# Altium project keyModule.PrjPcb
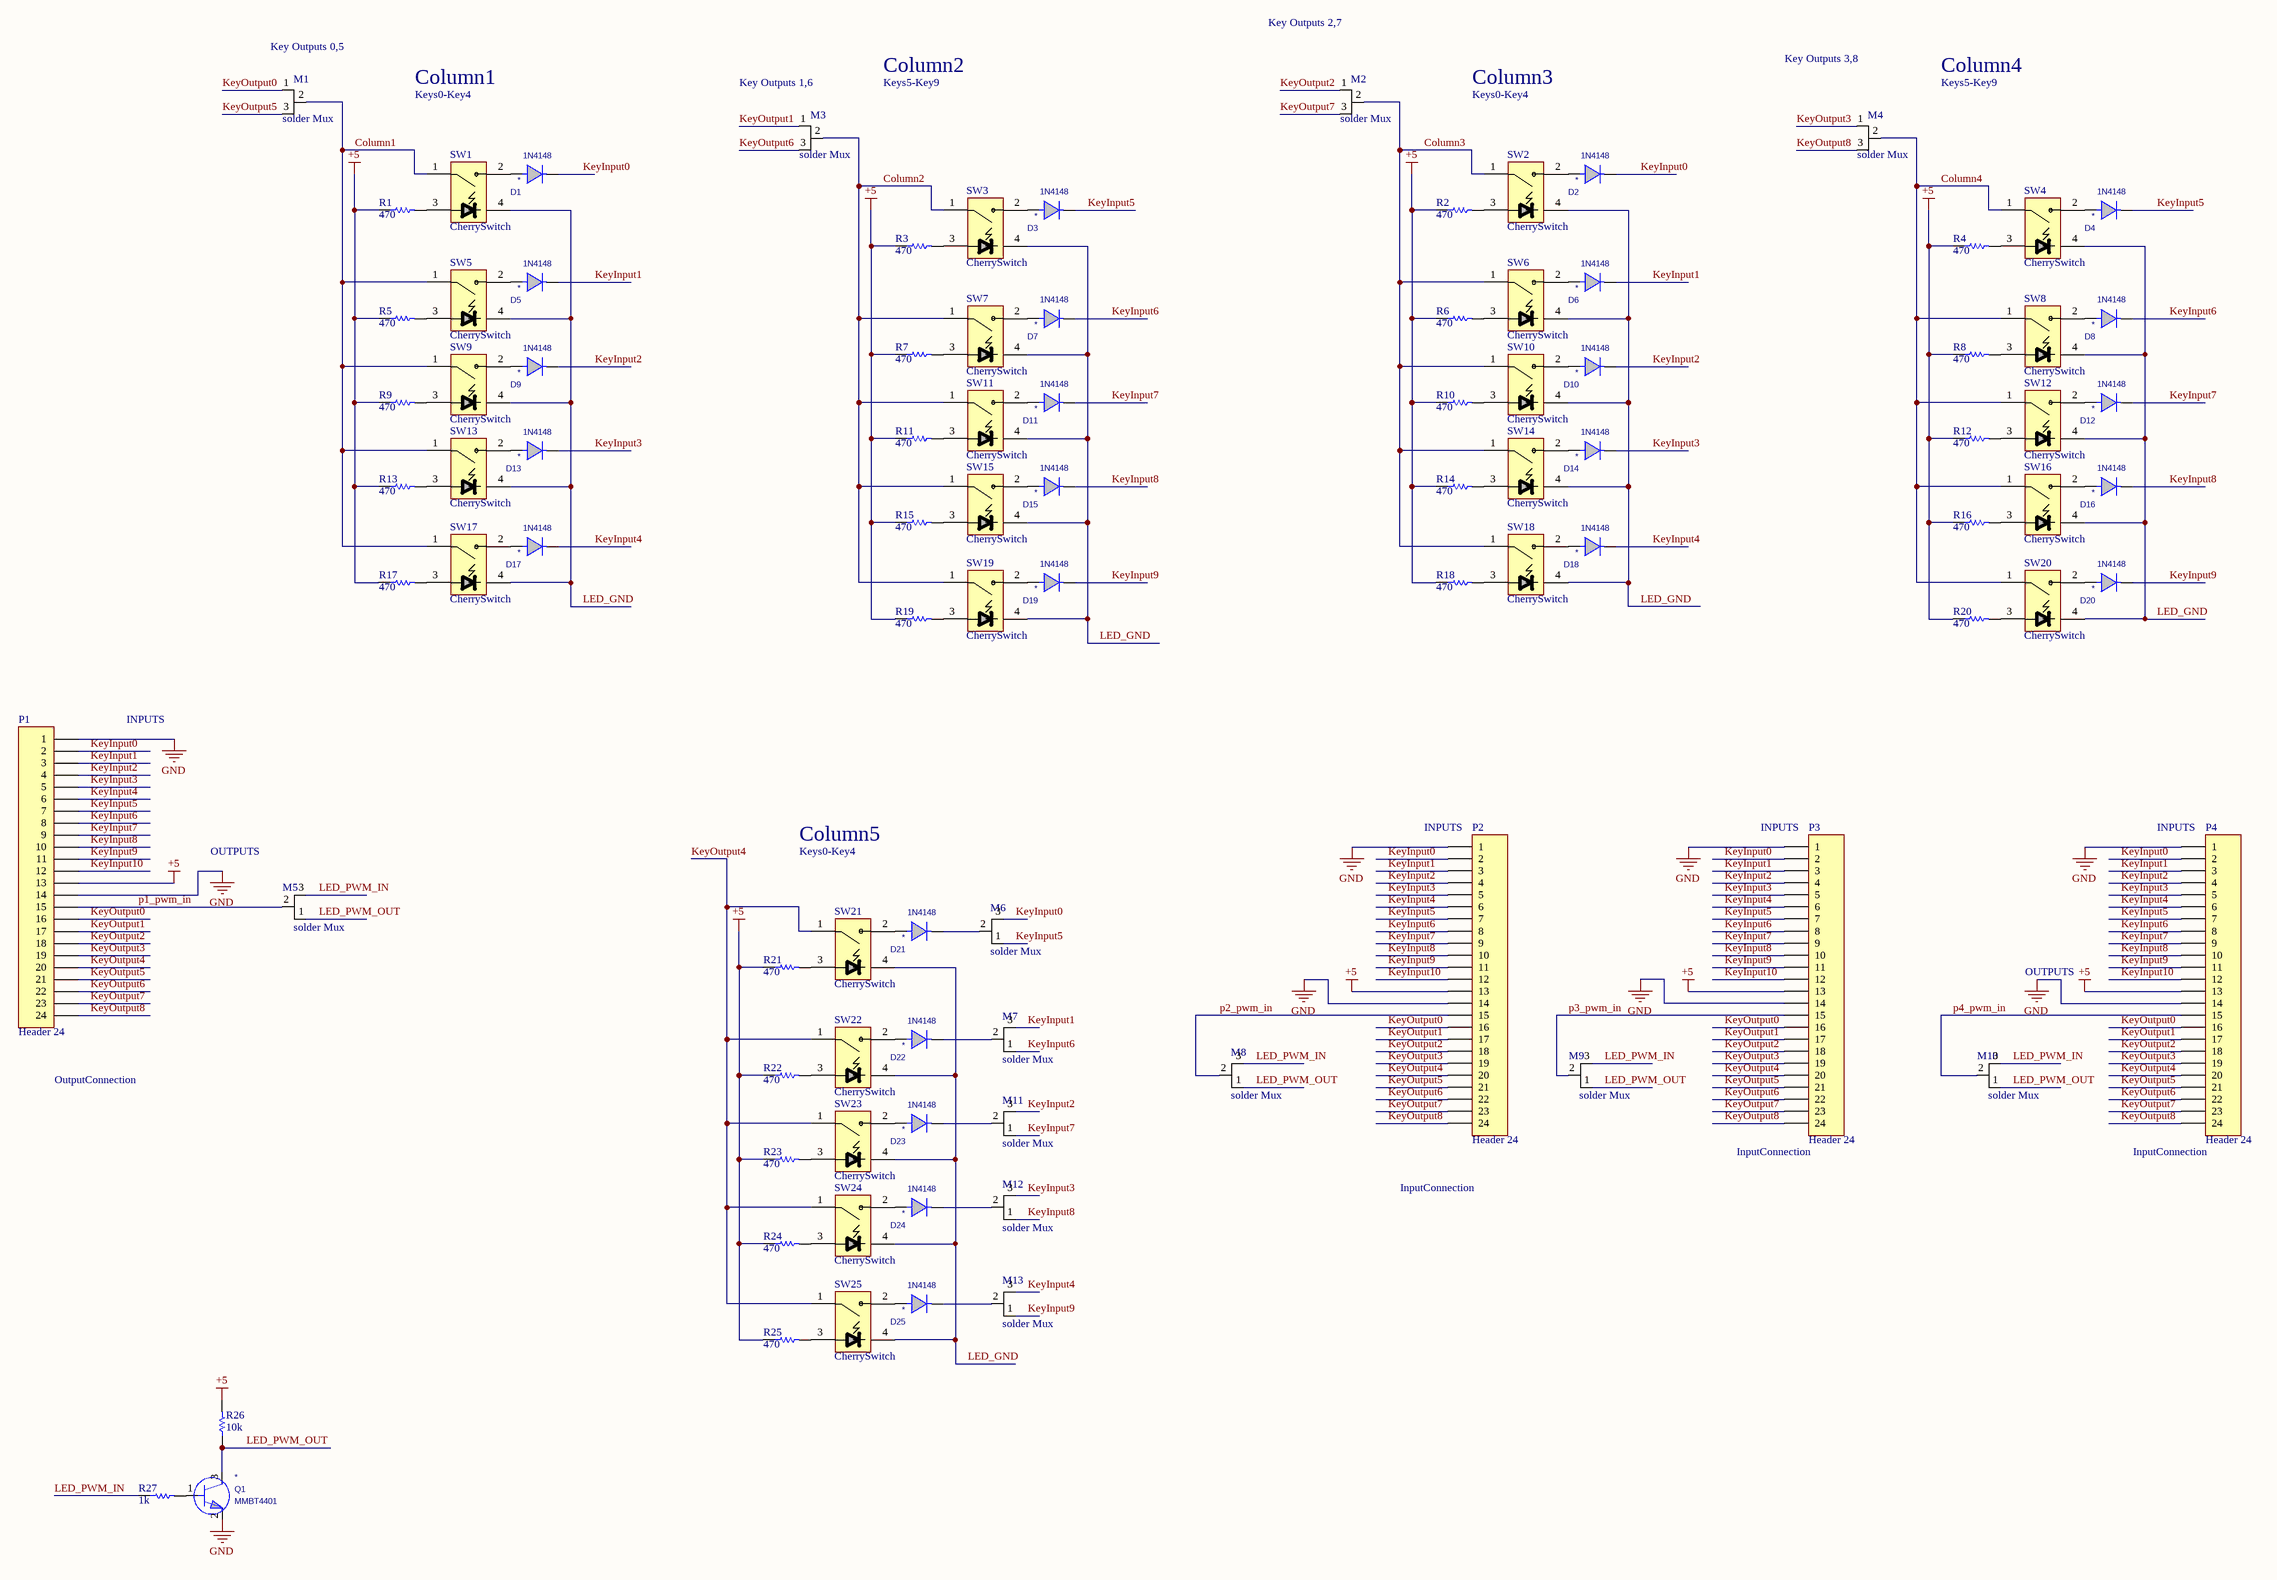
[diagram p0: keyModule.SchDoc]
1 sheet, 95 parts. Net scope: global (net labels, ports and power ports of the same name join across sheets).
Board file: keyModule.PcbDoc

## Sheet keyModule.SchDoc
size C

### Parts
D1  1N4148  [axial with SOD-323F]
D2  1N4148  [axial with SOD-323F]
D3  1N4148  [axial with SOD-323F]
D4  1N4148  [axial with SOD-323F]
D5  1N4148  [axial with SOD-323F]
D6  1N4148  [axial with SOD-323F]
D7  1N4148  [axial with SOD-323F]
D8  1N4148  [axial with SOD-323F]
D9  1N4148  [axial with SOD-323F]
D10  1N4148  [axial with SOD-323F]
D11  1N4148  [axial with SOD-323F]
D12  1N4148  [axial with SOD-323F]
D13  1N4148  [axial with SOD-323F]
D14  1N4148  [axial with SOD-323F]
D15  1N4148  [axial with SOD-323F]
D16  1N4148  [axial with SOD-323F]
D17  1N4148  [axial with SOD-323F]
D18  1N4148  [axial with SOD-323F]
D19  1N4148  [axial with SOD-323F]
D20  1N4148  [axial with SOD-323F]
D21  1N4148  [axial with SOD-323F]
D22  1N4148  [axial with SOD-323F]
D23  1N4148  [axial with SOD-323F]
D24  1N4148  [axial with SOD-323F]
D25  1N4148  [axial with SOD-323F]
M1  solder Mux  [SolderSelect]
M2  solder Mux  [SolderSelect]
M3  solder Mux  [SolderSelect]
M4  solder Mux  [SolderSelect]
M5  solder Mux  [SolderSelect]
M6  solder Mux  [SolderSelect]
M7  solder Mux  [SolderSelect]
M8  solder Mux  [SolderSelect]
M9  solder Mux  [SolderSelect]
M10  solder Mux  [SolderSelect]
M11  solder Mux  [SolderSelect]
M12  solder Mux  [SolderSelect]
M13  solder Mux  [SolderSelect]
P1  Header 24  [HDR1X24]
P2  Header 24  [HDR1X24]
P3  Header 24  [HDR1X24]
P4  Header 24  [HDR1X24]
Q1  value MMBT4401  [SOT23-3]  (hidden comment: NPN_TRANSISTOR)
R1  value 470  [RESC2012L]  (hidden comment: Res Semi)
R2  value 470  [RESC2012L]  (hidden comment: Res Semi)
R3  value 470  [RESC2012L]  (hidden comment: Res Semi)
R4  value 470  [RESC2012L]  (hidden comment: Res Semi)
R5  value 470  [RESC2012L]  (hidden comment: Res Semi)
R6  value 470  [RESC2012L]  (hidden comment: Res Semi)
R7  value 470  [RESC2012L]  (hidden comment: Res Semi)
R8  value 470  [RESC2012L]  (hidden comment: Res Semi)
R9  value 470  [RESC2012L]  (hidden comment: Res Semi)
R10  value 470  [RESC2012L]  (hidden comment: Res Semi)
R11  value 470  [RESC2012L]  (hidden comment: Res Semi)
R12  value 470  [RESC2012L]  (hidden comment: Res Semi)
R13  value 470  [RESC2012L]  (hidden comment: Res Semi)
R14  value 470  [RESC2012L]  (hidden comment: Res Semi)
R15  value 470  [RESC2012L]  (hidden comment: Res Semi)
R16  value 470  [RESC2012L]  (hidden comment: Res Semi)
R17  value 470  [RESC2012L]  (hidden comment: Res Semi)
R18  value 470  [RESC2012L]  (hidden comment: Res Semi)
R19  value 470  [RESC2012L]  (hidden comment: Res Semi)
R20  value 470  [RESC2012L]  (hidden comment: Res Semi)
R21  value 470  [RESC2012L]  (hidden comment: Res Semi)
R22  value 470  [RESC2012L]  (hidden comment: Res Semi)
R23  value 470  [RESC2012L]  (hidden comment: Res Semi)
R24  value 470  [RESC2012L]  (hidden comment: Res Semi)
R25  value 470  [RESC2012L]  (hidden comment: Res Semi)
R26  value 10k  [RESC2012L]  (hidden comment: Res Semi)
R27  value 1k  [RESC2012L]  (hidden comment: Res Semi)
SW1  CherrySwitch  [CherryMxSwitch]
SW2  CherrySwitch  [CherryMxSwitch]
SW3  CherrySwitch  [CherryMxSwitch]
SW4  CherrySwitch  [CherryMxSwitch]
SW5  CherrySwitch  [CherryMxSwitch]
SW6  CherrySwitch  [CherryMxSwitch]
SW7  CherrySwitch  [CherryMxSwitch]
SW8  CherrySwitch  [CherryMxSwitch]
SW9  CherrySwitch  [CherryMxSwitch]
SW10  CherrySwitch  [CherryMxSwitch]
SW11  CherrySwitch  [CherryMxSwitch]
SW12  CherrySwitch  [CherryMxSwitch]
SW13  CherrySwitch  [CherryMxSwitch]
SW14  CherrySwitch  [CherryMxSwitch]
SW15  CherrySwitch  [CherryMxSwitch]
SW16  CherrySwitch  [CherryMxSwitch]
SW17  CherrySwitch  [CherryMxSwitch]
SW18  CherrySwitch  [CherryMxSwitch]
SW19  CherrySwitch  [CherryMxSwitch]
SW20  CherrySwitch  [CherryMxSwitch]
SW21  CherrySwitch  [CherryMxSwitch]
SW22  CherrySwitch  [CherryMxSwitch]
SW23  CherrySwitch  [CherryMxSwitch]
SW24  CherrySwitch  [CherryMxSwitch]
SW25  CherrySwitch  [CherryMxSwitch]

### Nets
+5: P1.13 P2.13 P3.13 P4.13 R1.1 R2.1 R3.1 R4.1 R5.1 R6.1 R7.1 R8.1 R9.1 R10.1 R11.1 R12.1 R13.1 R14.1 R15.1 R16.1 R17.1 R18.1 R19.1 R20.1 R21.1 R22.1 R23.1 R24.1 R25.1 R26.2
GND: P1.1 P1.14 P2.1 P2.14 P3.1 P3.14 P4.1 P4.14 Q1.2(emitter)
Column1: M1.2 SW1.1 SW5.1 SW9.1 SW13.1 SW17.1
Column2: M3.2 SW3.1 SW7.1 SW11.1 SW15.1 SW19.1
Column3: M2.2 SW2.1 SW6.1 SW10.1 SW14.1 SW18.1
Column4: M4.2 SW4.1 SW8.1 SW12.1 SW16.1 SW20.1
KeyInput0: D1.1(CATHODE) D2.1(CATHODE) M6.3 P1.2 P2.2 P3.2 P4.2
KeyInput1: D5.1(CATHODE) D6.1(CATHODE) M7.3 P1.3 P2.3 P3.3 P4.3
KeyInput2: D9.1(CATHODE) D10.1(CATHODE) M11.3 P1.4 P2.4 P3.4 P4.4
KeyInput3: D13.1(CATHODE) D14.1(CATHODE) M12.3 P1.5 P2.5 P3.5 P4.5
KeyInput4: D17.1(CATHODE) D18.1(CATHODE) M13.3 P1.6 P2.6 P3.6 P4.6
KeyInput5: D3.1(CATHODE) D4.1(CATHODE) M6.1 P1.7 P2.7 P3.7 P4.7
KeyInput6: D7.1(CATHODE) D8.1(CATHODE) M7.1 P1.8 P2.8 P3.8 P4.8
KeyInput7: D11.1(CATHODE) D12.1(CATHODE) M11.1 P1.9 P2.9 P3.9 P4.9
KeyInput8: D15.1(CATHODE) D16.1(CATHODE) M12.1 P1.10 P2.10 P3.10 P4.10
KeyInput9: D19.1(CATHODE) D20.1(CATHODE) M13.1 P1.11 P2.11 P3.11 P4.11
KeyInput10: P1.12 P2.12 P3.12 P4.12
KeyOutput0: M1.1 P1.16 P2.16 P3.16 P4.16
KeyOutput1: M3.1 P1.17 P2.17 P3.17 P4.17
KeyOutput2: M2.1 P1.18 P2.18 P3.18 P4.18
KeyOutput3: M4.1 P1.19 P2.19 P3.19 P4.19
KeyOutput4: P1.20 P2.20 P3.20 P4.20 SW21.1 SW22.1 SW23.1 SW24.1 SW25.1
KeyOutput5: M1.3 P1.21 P2.21 P3.21 P4.21
KeyOutput6: M3.3 P1.22 P2.22 P3.22 P4.22
KeyOutput7: M2.3 P1.23 P2.23 P3.23 P4.23
KeyOutput8: M4.3 P1.24 P2.24 P3.24 P4.24
LED_GND: SW1.4 SW2.4 SW3.4 SW4.4 SW5.4 SW6.4 SW7.4 SW8.4 SW9.4 SW10.4 SW11.4 SW12.4 SW13.4 SW14.4 SW15.4 SW16.4 SW17.4 SW18.4 SW19.4 SW20.4 SW21.4 SW22.4 SW23.4 SW24.4 SW25.4
LED_PWM_IN: M5.3 M8.3 M9.3 M10.3 R27.1
LED_PWM_OUT: M5.1 M8.1 M9.1 M10.1 Q1.3(collector) R26.1
p1_pwm_in: M5.2 P1.15
p2_pwm_in: M8.2 P2.15
p3_pwm_in: M9.2 P3.15
p4_pwm_in: M10.2 P4.15
NetD1_2: D1.2(ANODE) SW1.2
NetD2_2: D2.2(ANODE) SW2.2
NetD3_2: D3.2(ANODE) SW3.2
NetD4_2: D4.2(ANODE) SW4.2
NetD5_2: D5.2(ANODE) SW5.2
NetD6_2: D6.2(ANODE) SW6.2
NetD7_2: D7.2(ANODE) SW7.2
NetD8_2: D8.2(ANODE) SW8.2
NetD9_2: D9.2(ANODE) SW9.2
NetD10_2: D10.2(ANODE) SW10.2
NetD11_2: D11.2(ANODE) SW11.2
NetD12_2: D12.2(ANODE) SW12.2
NetD13_2: D13.2(ANODE) SW13.2
NetD14_2: D14.2(ANODE) SW14.2
NetD15_2: D15.2(ANODE) SW15.2
NetD16_2: D16.2(ANODE) SW16.2
NetD17_2: D17.2(ANODE) SW17.2
NetD18_2: D18.2(ANODE) SW18.2
NetD19_2: D19.2(ANODE) SW19.2
NetD20_2: D20.2(ANODE) SW20.2
NetD21_1: D21.1(CATHODE) M6.2
NetD21_2: D21.2(ANODE) SW21.2
NetD22_1: D22.1(CATHODE) M7.2
NetD22_2: D22.2(ANODE) SW22.2
NetD23_1: D23.1(CATHODE) M11.2
NetD23_2: D23.2(ANODE) SW23.2
NetD24_1: D24.1(CATHODE) M12.2
NetD24_2: D24.2(ANODE) SW24.2
NetD25_1: D25.1(CATHODE) M13.2
NetD25_2: D25.2(ANODE) SW25.2
NetQ1_1: Q1.1(base) R27.2
NetR1_2: R1.2 SW1.3
NetR2_2: R2.2 SW2.3
NetR3_2: R3.2 SW3.3
NetR4_2: R4.2 SW4.3
NetR5_2: R5.2 SW5.3
NetR6_2: R6.2 SW6.3
NetR7_2: R7.2 SW7.3
NetR8_2: R8.2 SW8.3
NetR9_2: R9.2 SW9.3
NetR10_2: R10.2 SW10.3
NetR11_2: R11.2 SW11.3
NetR12_2: R12.2 SW12.3
NetR13_2: R13.2 SW13.3
NetR14_2: R14.2 SW14.3
NetR15_2: R15.2 SW15.3
NetR16_2: R16.2 SW16.3
NetR17_2: R17.2 SW17.3
NetR18_2: R18.2 SW18.3
NetR19_2: R19.2 SW19.3
NetR20_2: R20.2 SW20.3
NetR21_2: R21.2 SW21.3
NetR22_2: R22.2 SW22.3
NetR23_2: R23.2 SW23.3
NetR24_2: R24.2 SW24.3
NetR25_2: R25.2 SW25.3

### Notes on the sheet
- Key Outputs 2,7
- (near M1) Key Outputs 0,5
- Column1
- (near M3) Key Outputs 1,6
- Column2
- Keys5-Key9
- Column3
- Key Outputs 3,8
- Column4
- Keys0-Key4
- INPUTS
- OUTPUTS
- Column5
- (near P2) INPUTS
- (near P3) INPUTS
- (near P4) INPUTS
- OutputConnection
- (near P3) InputConnection
- (near P4) InputConnection
- InputConnection
- Title
- Size:
- Date:
- File:
- C
- Number:
- Time:
- Revision:
- Sheet
- of

### Library data of the parts
D1-D25 = 5283: Diode, 1N4148, 75V, 0.4 in., DO-35, 150mA, Switching, 500mW, Any; LeadSpacing: 0.4 in.; Reference: g:\accel_lib\datasheets\1N914-916-4148-Fairchild.PDF; plIDX: 5283; DNS: *; Value: 1N4148; Package: DO-35; Wattage: 500mW; Vendor: Any; DiodeType: Switching; Voltage: 75V; Amperage: 150mA; CheckedBy: B. Lyon; ModifyDate: 08/27/2007 16:11:30; ComponentType: Diode; Cost: 0.0038; ComponentLink4URL: https://pdm.iconfitness.com/PDM/EBOM/PartsMaintenance/PartsMaintenance.aspx?Editplidx=5283; ComponentLink4Description: PDM Parts Maintenance
P1-P4 = Header 24: Header, 24-Pin; LatestRevisionDate: 17-Jul-2002; LatestRevisionNote: Re-released for DXP Platform.; Publisher: Altium Limited
Q1 = 265442: Transistor, MMBT4401, 40V, SOT23-3, 500mA, NPN, Transistor, On Semi: MMBT4401LT1; plIDX: 265442; CheckedBy: gdeguzman; DNS: *; ComponentType: Transistor; CreatedBy: Mike Tyger; LastUpdatedBy: Mike Tyger; Cost: 0.0094; Voltage: 40V; Package: SOT23-3; Amperage: 500mA; TransistorType: NPN; ChipType: Transistor; Vendor: On Semi: MMBT4401LT1; ComponentLink4URL: https://pdm.iconfitness.com/PDM/EBOM/PartsMaintenance/PartsMaintenance.aspx?Editplidx=265442; ComponentLink4Description: PDM Parts Maintenance
R1-R27 = Res Semi: Semiconductor Resistor; Published: 8-Jun-2000; LatestRevisionDate: 17-Jul-2002; LatestRevisionNote: Re-released for DXP Platform.; PackageReference: AXIAL-0.5; Publisher: Altium Limited
SW1-SW25 = CherrySwitch: Cherry MX Switch layout